# Altium project freq_conv_test_unit_sch.PrjPcb
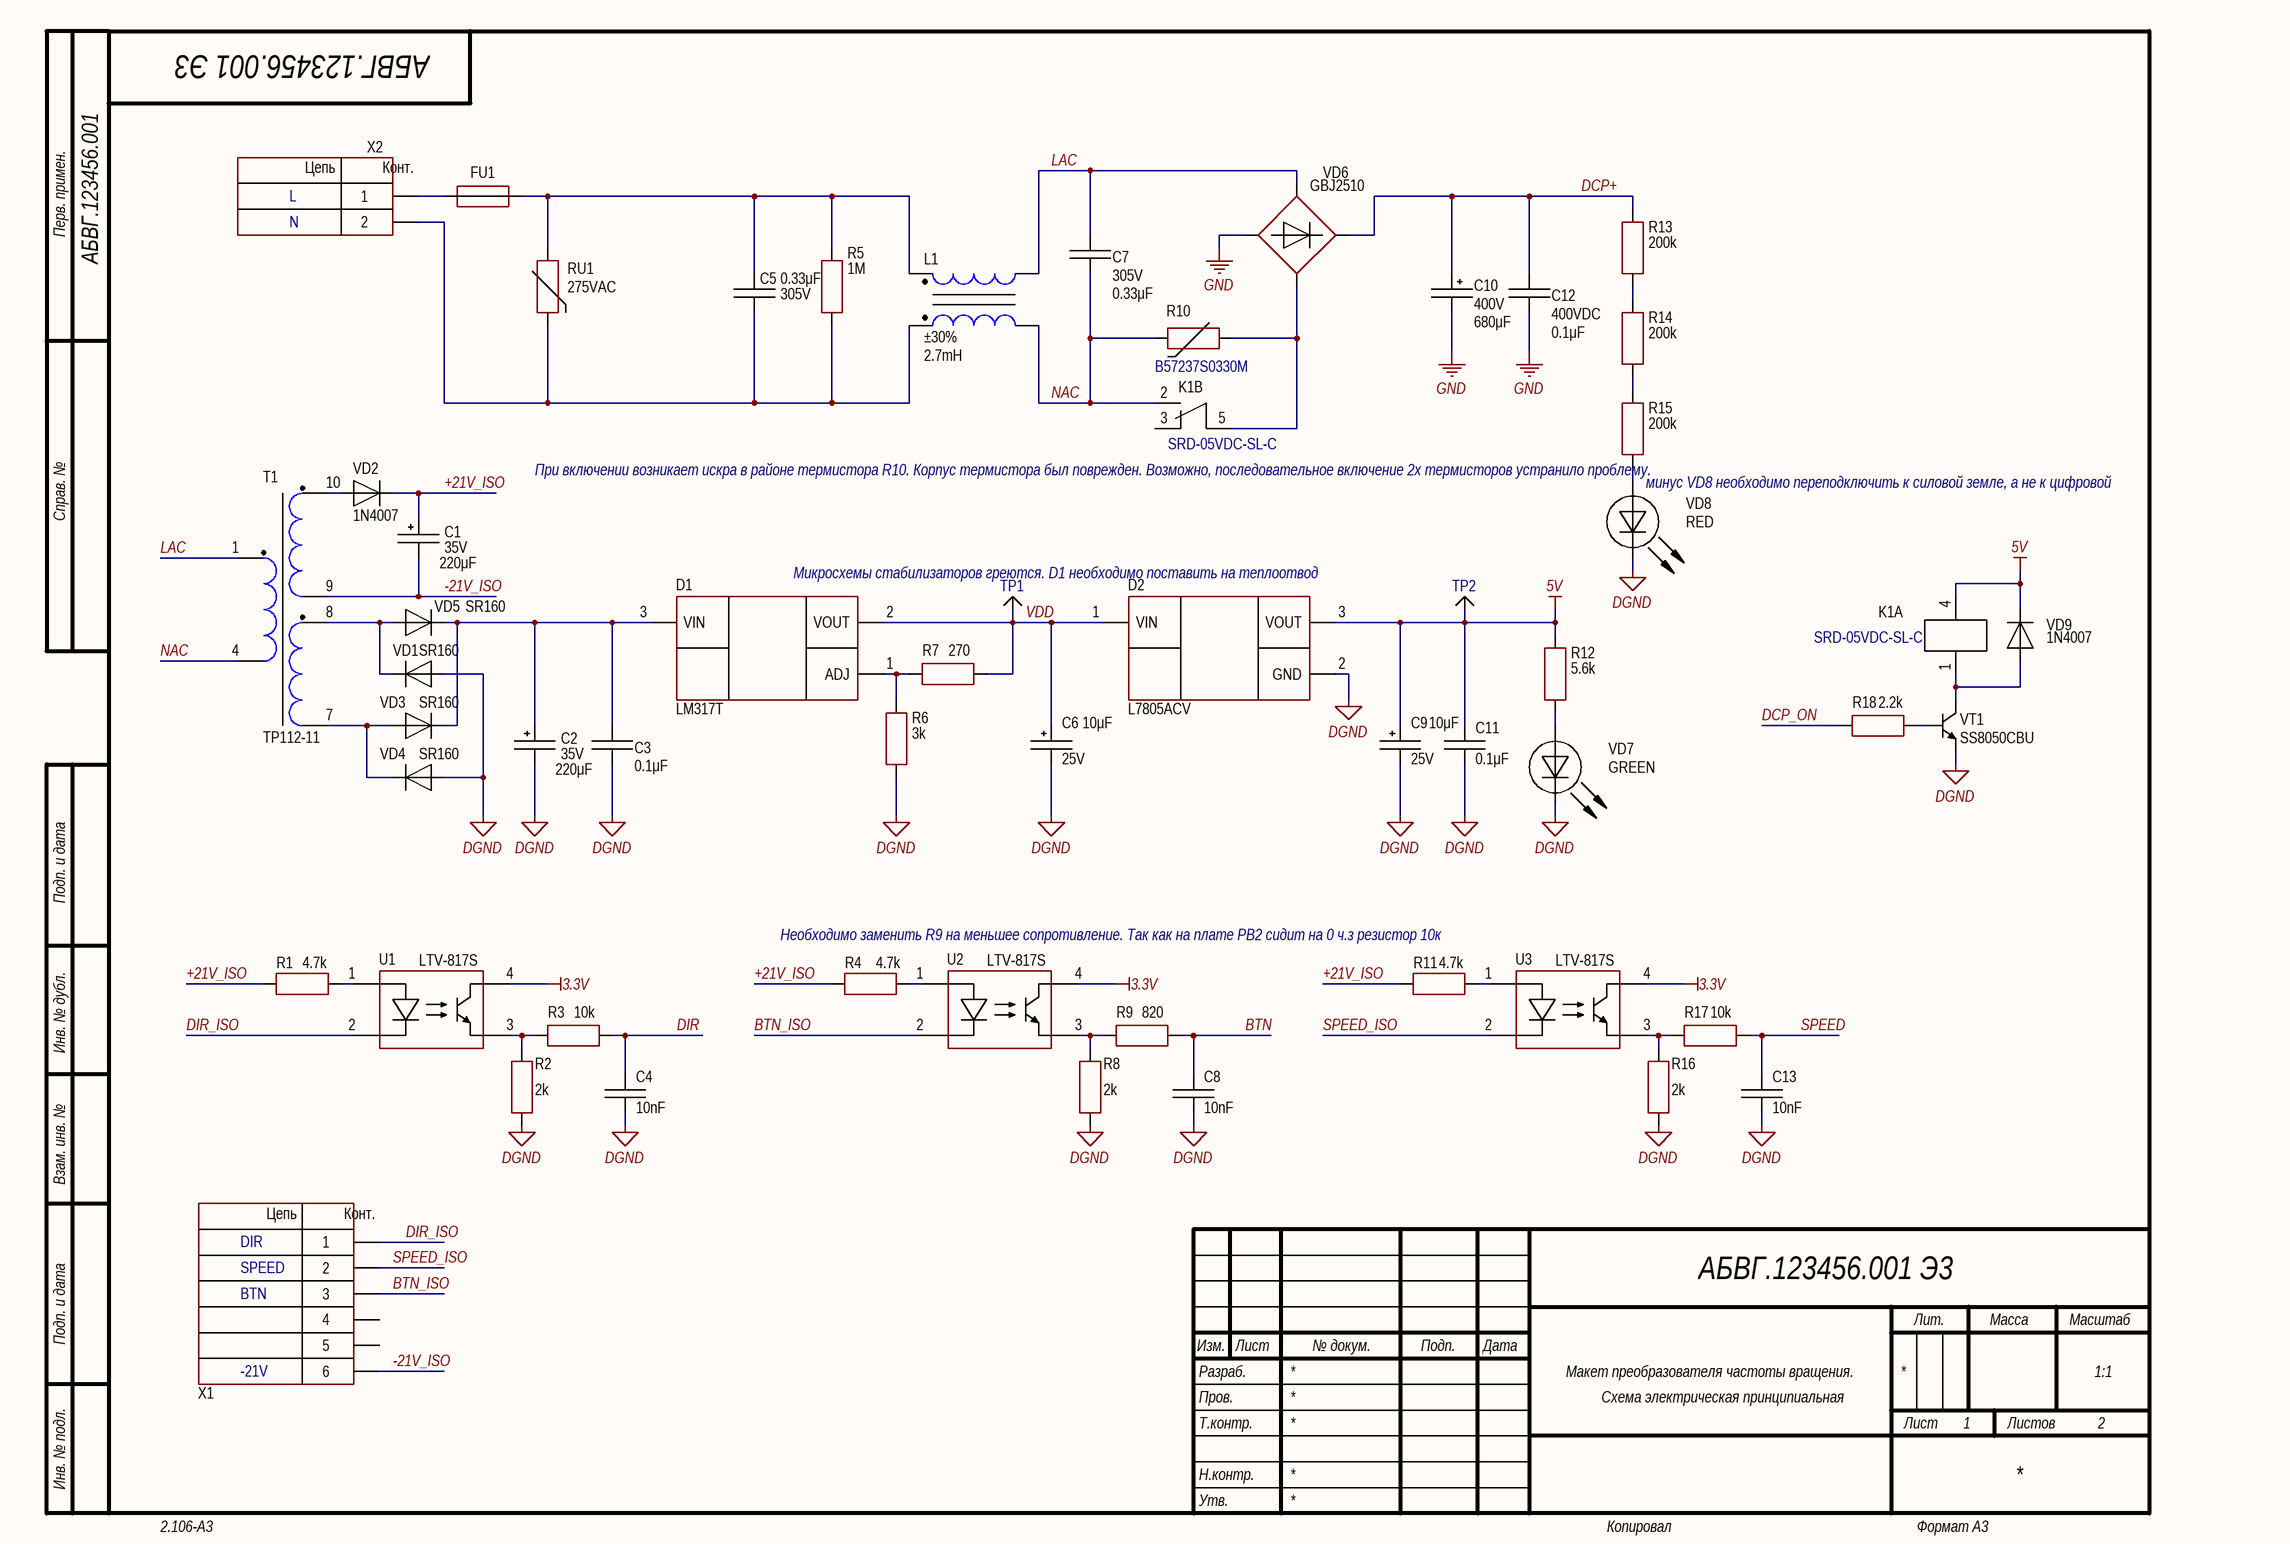
[diagram p0: Sheet1.SchDoc]
2 sheets, 127 parts. Net scope: global (net labels, ports and power ports of the same name join across sheets).
Board file: freq_conv_test_unit_pcb.PcbDoc
Sheets:
  Sheet1.SchDoc
  Sheet2.SchDoc

## Sheet Sheet1.SchDoc
size 420 x 297 mm; Address1: Address1; Address2: Address2; Address3: Address3; Address4: Address4; DocumentNumber: АБВГ.123456.001 Э3; SheetNumber: 1; SheetTotal: 2; Scale: 1:1; Title2str: Макет преобразователя частоты вращения.; DocumentType: Схема электрическая принципиальная; FirstReferrence: АБВГ.123456.001

### Parts
C1  value 220μF  Voltage: 35V  [CAP: D8C3.5H12]
C2  value 220μF  Voltage: 35V  [CAP: D8C3.5H12]
C3  value 0.1μF  [CAP: 1206]
C4  value 10nF  [CAP: 1206]
C5  value 0.33μF  Voltage: 305V  [CAP: B32922]
C6  value 10μF  Voltage: 25V  [CAP: D5C2H11]
C7  value 0.33μF  Voltage: 305V  [CAP: B32922]
C8  value 10nF  [CAP: 1206]
C9  value 10μF  Voltage: 25V  [CAP: D5C2H11]
C10  value 680μF  Voltage: 400V  [CAP: D30C10H37]
C11  value 0.1μF  [CAP: 1206]
C12  value 0.1μF  Voltage: 400VDC  [CAP: B32673]
C13  value 10nF  [CAP: 1206]
D1  PartNumber: LM317T  [TO-220F]
D2  PartNumber: L7805ACV  [TO-220F]
FU1  (no value)  [FUSE: FH-101]
K1  Relay, Non Latching, SPDT , 10A , (250VAC , 110VDC)  [SRD-05VDC-SL-C]  (value not drawn)  (parts A,B of 2)
L1  value 2.7mH  Tolerance: ±30%  [IND: B82723A]
R1  value 4.7k  [RES: 1206]
R2  value 2k  [RES: 1206]
R3  value 10k  [RES: 1206]
R4  value 4.7k  [RES: 1206]
R5  value 1M  [RES: Axial 15mm]  (hidden comment: *)
R6  value 3k  [RES: 1206]
R7  value 270  [RES: 1206]
R8  value 2k  [RES: 1206]
R9  value 820  [RES: 1206]  (hidden comment: Resistor film, 10k, ±5%, 1206, 0.25W, -55...+125°C)
R10  PartNumber: B57237S0330M  [RES: B57237 (NTC)]
R11  value 4.7k  [RES: 1206]
R12  value 5.6k  [RES: 1206]
R13  value 200k  [RES: 1206]
R14  value 200k  [RES: 1206]
R15  value 200k  [RES: 1206]
R16  value 2k  [RES: 1206]
R17  value 10k  [RES: 1206]
R18  value 2.2k  [RES: 1206]
RU1  MaxVoltage: 275VAC  [VARISTOR: B72214]
T1  Package: TP112-11  [TRANS: TP-112]
TP1  Test_Point  [TEST POINT KEYSTONE]  (value not drawn)
TP2  Test_Point  [TEST POINT KEYSTONE]  (value not drawn)
U1  PartNumber: LTV-817S  [4-SMD]
U2  PartNumber: LTV-817S  [4-SMD]
U3  PartNumber: LTV-817S  [4-SMD]
VD1  PartNumber: SR160  [DIODE: DO41]
VD2  PartNumber: 1N4007  [DIODE: DO41]
VD3  PartNumber: SR160  [DIODE: DO41]
VD4  PartNumber: SR160  [DIODE: DO41]
VD5  PartNumber: SR160  [DIODE: DO41]
VD6  (no value)  [DIODE: GBJ FLAT]
VD7  Color: GREEN  [LED: 1206G]
VD8  Color: RED  [LED: 1206R]
VD9  PartNumber: 1N4007  [DIODE: DO41]
VT1  (no value)  [TO-92 - formed leads]
X1  (no value)  [CON: PLS-6]
X2  (no value)  [DG128-7.5-02P]

### Nets
3.3V: U1.4(C) U2.4(C) U3.4(C)
5V: C9.1 C11.2 D2.3(VOUT) K1.4 R12.2 TP2.1 VD9.2
DGND: C2.2 C3.1 C4.1 C6.2 C8.1 C9.2 C11.1 C13.1 D2.2(GND) R2.1 R6.1 R8.1 R16.1 VD1.1 VD4.1 VD7.2(C) VD8.2(C) VT1.1(E)
GND: C10.2 C12.2 VD6.1
+21V_ISO: C1.1 R1.1 R4.1 R11.1 VD2.2
-21V_ISO: C1.2 T1.9 X1.6
BTN: C8.2 R9.1
BTN_ISO: U2.2(C) X1.3
DCP+: C10.1 C12.1 R13.2 VD6.3
DCP_ON: R18.1
DIR: C4.2 R3.1
DIR_ISO: U1.2(C) X1.1
LAC: C7.1 L1.1 T1.1 VD6.2
NAC: C7.2 K1.2 L1.4 R10.2 T1.4
SPEED: C13.2 R17.1
SPEED_ISO: U3.2(C) X1.2
VDD: C6.1 D1.2(VOUT) D2.1(VIN) R7.2 TP1.1
NetC2_1: C2.1 C3.2 D1.3(VIN) VD3.2 VD5.2
NetC5_1: C5.1 FU1.2 L1.2 R5.2 RU1.1
NetC5_2: C5.2 L1.3 R5.1 RU1.2 X2.2
NetD1_1: D1.1(ADJ) R6.2 R7.1
NetFU1_1: FU1.1 X2.1
NetK1_1: K1.1 VD9.1 VT1.3(C)
NetK1_5: K1.5 R10.1 VD6.4
NetR1_2: R1.2 U1.1(A)
NetR2_2: R2.2 R3.2 U1.3(E)
NetR4_2: R4.2 U2.1(A)
NetR8_2: R8.2 R9.2 U2.3(E)
NetR11_2: R11.2 U3.1(A)
NetR12_1: R12.1 VD7.1(A)
NetR13_1: R13.1 R14.2
NetR14_1: R14.1 R15.2
NetR15_1: R15.1 VD8.1(A)
NetR16_2: R16.2 R17.2 U3.3(E)
NetR18_2: R18.2 VT1.2(B)
NetT1_7: T1.7 VD3.1 VD4.2
NetT1_8: T1.8 VD1.2 VD5.1
NetT1_10: T1.10 VD2.1

Not connected (* = marked no-connect by the designer): K1 3; X1 4 5

### Notes on the sheet
- L
- N
- (near R15) При включении возникает искра в районе термистора R10. Корпус термистора был поврежден. Возможно, последовательное включение 2х термисторов устранило проблему.
- минус VD8 необходимо переподключить к силовой земле, а не к цифровой
- (near TP1) Микросхемы стабилизаторов греются. D1 необходимо поставить на теплоотвод
- Необходимо заменить R9 на меньшее сопротивление. Так как на плате PB2 сидит на 0 ч.з резистор 10к
- DIR
- SPEED
- BTN
- -21V
- Перв. примен.
- Справ. №
- Подп. и дата
- Инв. № дубл.
- Взам. инв. №
- Разраб.
- Изм.
- Лист
- № докум.
- Подп.
- Дата
- Лит.
- Масса
- Масштаб
- Пров.
- Т.контр.
- Листов
- Инв. № подл.
- Утв.
- Н.контр.
- 2.106-A3
- Копировал
- Формат А3
- (in symbol KLS2-128-7.50-02P-4S (DG128-7.5-02P)) Цепь; Конт.
- (in symbol PLS-6) Цепь; Конт.

### Library data of the parts
C1 C2 = Aluminium: PartNumber: 9000565901; ValueManufacturerPartNumber: Aluminium capacitor, 220μF, 35V, ±20%, 54mOhm, 8x12x3.5 mm, -40...+105°C; TypeCapacitor: Aluminium capacitor; Tolerance: ±20%; Impedance: 54mOhm; Art: 9000565902; Manufacturer: ?; Package: 8x12x3.5 mm; HelpURL: https://www.chipdip.ru/product0/9000565902; Temperature: -40...+105°C; Price ChipDip: 13
C3 C11 = Ceramic_1206: PartNumber: Ceramic capacitor, 0.1μF,   50V; ValueManufacturerPartNumber: Ceramic capacitor, 0.1μF, X7R, ±10%, 50V, 1206, -55...+125°C; TypeCapacitor: Ceramic capacitor; Tolerance: ±10%; TypeDielectric: X7R; Voltage: 50V; Manufacturer: *; Package: 1206; HelpURL: https://www.chipdip.ru/product0/42211; Temperature: -55...+125°C; Price ChipDip: 11
C4 C8 C13 = Ceramic_1206: PartNumber: Ceramic capacitor, 10nF,   50V; ValueManufacturerPartNumber: Ceramic capacitor, 10nF, X7R, ±10%, 50V, 1206, -55...+125°C; TypeCapacitor: Ceramic capacitor; Tolerance: ±10%; TypeDielectric: X7R; Voltage: 50V; Manufacturer: *; Package: 1206; HelpURL: https://www.chipdip.ru/product0/17180; Temperature: -55...+125°C; Price ChipDip: 13
  C4: ClassName: optoiso1
  C8: ClassName: optoiso2
  C13: ClassName: optoiso3
C5 C7 = Film: Manufacturer: Epcos; PartNumber: B32922-C3334-K; ValueManufacturerPartNumber: Film capacitor X2, 0.33μF, 305V, ±10%, ?, 18x14x8, -40...+110°C; TypeCapacitor: Film capacitor X2; Tolerance: ±10%; Package: 18x14x8; HelpURL: https://www.chipdip.ru/product/b32922-c3334-k; Temperature: -40...+110°C; Impedance: ?; Price ChipDip: 59
C6 C9 = Aluminium: PartNumber: 9000565842; ValueManufacturerPartNumber: Aluminium capacitor, 10μF, 25V, ±20%, 54mOhm, ?, -40...+105°C; TypeCapacitor: Aluminium capacitor; Tolerance: ±20%; Impedance: 54mOhm; Manufacturer: ?; Package: ?; HelpURL: https://www.chipdip.ru/product0/9000565842; Temperature: -40...+105°C; Price ChipDip: 9; Art: 9000565842
C10 = Aluminium: Manufacturer: JB Capacitors; PartNumber: JNE2G681M10003000600; ValueManufacturerPartNumber: Aluminium capacitor, 680μF, 400V, ±20%, ?, 30x10x60 mm, -25...+105°C; TypeCapacitor: Aluminium capacitor; Tolerance: ±20%; Art: 9000565973; Package: 30x10x60 mm; HelpURL: https://www.chipdip.ru/product0/9000565973; Temperature: -25...+105°C; Impedance: ?; Price ChipDip: 700; Price Ali: 853
C12 = Film: Manufacturer: Epcos; PartNumber: B32683A4104J000; ValueManufacturerPartNumber: Film capacitor, 0.1μF, 400VDC, ±10%, ?, 26.5x16.5x8.5 mm, -55...+100°C; TypeCapacitor: Film capacitor; Tolerance: ±10%; Package: 26.5x16.5x8.5 mm; HelpURL: https://www.chipdip.ru/product0/9000614069; Temperature: -55...+100°C; Impedance: ?; Price ChipDip: 160; Price Ali: 90
D1 = LM317: Adjustable voltage regulator; Manufacturer: STMicroelectronics; VoltageInput: 1.2…37V; CurrentOutput: 1.5A; Art: 268916202; HelpURL: https://www.chipdip.ru/product/lm317t; Package: TO-220SG; ComponentType: Adjustable voltage regulator; ValueManufacturerPartNumber: =ComponentType+', '+DataRate+', '+Isolation+', '+Supply+', '+Temperature+', '+Package; Temperature: 0...125°C; MaxDropout: *; VoltageOutput: *; Price ChipDip: 60
D2 = 78XX: Linear voltage regulator; Manufacturer: STMicroelectronics; VoltageInput: 35V; CurrentOutput: 1.5A; VoltageOutput: 5V; Art: 9000107125; HelpURL: https://www.chipdip.ru/product/l7805acv-dg; Package: *; ComponentType: Linear voltage regulator; ValueManufacturerPartNumber: =ComponentType+', '+DataRate+', '+Isolation+', '+Supply+', '+Temperature+', '+Package; Temperature: *; MaxDropout: *; Price ChipDip: 41
FU1 = FUSE: Manufacturer: Dragon City Industries; PartNumber: FH-101; ValueManufacturerPartNumber: *,  FH-101, *; Art: 45989; Package: FH-101; HelpURL: https://www.chipdip.ru/product/fh-101; Temperature: *; Value: *; Price ChipDip: 38
K1 = SRD-05VDC-SL-C: Manufacturer: Ningbo Songle Relay; Switching Voltage: (250VAC , 110VDC) Max; Coil Voltage: 5VDC; HelpURL: https://www.chipdip.ru/product0/8001965486?from=suggest_product; CurrentMax: 10A; Price ChipDip: 160; PartNumber: SRD-05VDC-SL-C
L1 = B82723A: Manufacturer: TDK (TDK-Lambda); PartNumber: B82723A2402N1; TypeInductor: Fixed inductor; TypeMatiriel: CuNi18Zn20; Stray inductance: 30uH; Rated voltage: 250V; Package: B82723A; HelpURL: https://www.chipdip.ru/product0/8534720954; ValueManufacturerPartNumber: =TypeInductor+', '+Value+', '+Tolerance+', '+Package+', '+TypeMatiriel+', '+AL; Price ChipDip: 400
R1 R4 R11 = Resistor_1206: Manufacturer: Yageo; PartNumber: RC1206JR-07100RL; ValueManufacturerPartNumber: Resistor film, 4.7k, ±5%, 1206, 0.25W, -55...+125°C; TypeResistor: Resistor film; Power: 0.25W; Tolerance: ±5%; Package: 1206; HelpURL: https://www.digikey.com/product-detail/en/yageo/RC1206JR-07100RL/311-100ERCT-ND/732153; Temperature: -55...+125°C
  R1: ClassName: optoiso1
  R4: ClassName: optoiso2
  R11: ClassName: optoiso3
R2 R8 R16 = Resistor_1206: Manufacturer: Yageo; PartNumber: RC1206JR-07100RL; ValueManufacturerPartNumber: Resistor film, 2k, ±5%, 1206, 0.25W, -55...+125°C; TypeResistor: Resistor film; Power: 0.25W; Tolerance: ±5%; Package: 1206; HelpURL: https://www.digikey.com/product-detail/en/yageo/RC1206JR-07100RL/311-100ERCT-ND/732153; Temperature: -55...+125°C
  R2: ClassName: optoiso1
  R8: ClassName: optoiso2
  R16: ClassName: optoiso3
R3 R17 = Resistor_1206: Manufacturer: Yageo; PartNumber: RC1206JR-07100RL; ValueManufacturerPartNumber: Resistor film, 10k, ±5%, 1206, 0.25W, -55...+125°C; TypeResistor: Resistor film; Power: 0.25W; Tolerance: ±5%; Package: 1206; HelpURL: https://www.digikey.com/product-detail/en/yageo/RC1206JR-07100RL/311-100ERCT-ND/732153; Temperature: -55...+125°C
  R3: ClassName: optoiso1
  R17: ClassName: optoiso3
R5 = Resistor_Axial: Tolerance: ±5%; Manufacturer: *; PartNumber: *; Package: *; HelpURL: *; ValueManufacturerPartNumber: *; Temperature: *; TypeResistor: *; Power: *
R6 = Resistor_1206: Manufacturer: Yageo; PartNumber: RC1206JR-07100RL; ValueManufacturerPartNumber: Resistor film, 3k, ±5%, 1206, 0.25W, -55...+125°C; TypeResistor: Resistor film; Power: 0.25W; Tolerance: ±5%; Package: 1206; HelpURL: https://www.digikey.com/product-detail/en/yageo/RC1206JR-07100RL/311-100ERCT-ND/732153; Temperature: -55...+125°C
R7 = Resistor_1206: Manufacturer: Yageo; PartNumber: RC1206JR-07100RL; ValueManufacturerPartNumber: Resistor film, 270, ±5%, 1206, 0.25W, -55...+125°C; TypeResistor: Resistor film; Power: 0.25W; Tolerance: ±5%; Package: 1206; HelpURL: https://www.digikey.com/product-detail/en/yageo/RC1206JR-07100RL/311-100ERCT-ND/732153; Temperature: -55...+125°C
R9 = Resistor_1206: Manufacturer: Yageo; PartNumber: RC1206JR-07100RL; ValueManufacturerPartNumber: Resistor film, 820, ±5%, 1206, 0.25W, -55...+125°C; Package: 1206; HelpURL: https://www.digikey.com/product-detail/en/yageo/RC1206JR-07100RL/311-100ERCT-ND/732153; Temperature: -55...+125°C; TypeResistor: Resistor film; Power: 0.25W; Tolerance: ±5%; ClassName: optoiso2
R10 = NTC: Maximum permissible capacitance 900uF; Manufacturer: Epcos; ValueManufacturerPartNumber: NTC resistor, 33, ±20%, pitch 7.5mm, 2.5A, -55...+170°C; TypeResistor: NTC resistor; MaxCurrent: 2.5A; Tolerance: ±20%; Value: 33; Art: 8010235420; Package: pitch 7.5mm; HelpURL: https://www.chipdip.ru/product0/8010235420; Temperature: -55...+170°C; Price ChipDip: 38
R12 = Resistor_1206: Manufacturer: Yageo; PartNumber: RC1206JR-07100RL; ValueManufacturerPartNumber: Resistor film, 5.6k, ±5%, 1206, 0.25W, -55...+125°C; TypeResistor: Resistor film; Power: 0.25W; Tolerance: ±5%; Package: 1206; HelpURL: https://www.digikey.com/product-detail/en/yageo/RC1206JR-07100RL/311-100ERCT-ND/732153; Temperature: -55...+125°C
R13-R15 = Resistor_1206: Manufacturer: Yageo; PartNumber: RC1206JR-07100RL; ValueManufacturerPartNumber: Resistor film, 200k, ±5%, 1206, 0.25W, -55...+125°C; TypeResistor: Resistor film; Power: 0.25W; Tolerance: ±5%; Package: 1206; HelpURL: https://www.digikey.com/product-detail/en/yageo/RC1206JR-07100RL/311-100ERCT-ND/732153; Temperature: -55...+125°C
R18 = Resistor_1206: Manufacturer: Yageo; PartNumber: RC1206JR-07100RL; ValueManufacturerPartNumber: Resistor film, 2.2k, ±5%, 1206, 0.25W, -55...+125°C; TypeResistor: Resistor film; Power: 0.25W; Tolerance: ±5%; Package: 1206; HelpURL: https://www.digikey.com/product-detail/en/yageo/RC1206JR-07100RL/311-100ERCT-ND/732153; Temperature: -55...+125°C
RU1 = Varistor: Manufacturer: EPCOS; PartNumber: B72214-S 271-K101; ValueManufacturerPartNumber: Varistor, 275VAC, pitch 7mm,  -40…85°C; Package: pitch 7mm; HelpURL: https://www.chipdip.ru/product/b72214-s271-k101; Temperature: -40…85°C; TypeResistor: Varistor; Price ChipDip: 36
T1 = TP-112: ValueManufacturerPartNumber: Transformer, TP112-11; TypeTransformer: Transformer; Art: 26337; Manufacturer: ?; HelpURL: https://www.chipdip.ru/product/tp112-11; PartNumber: TP112-11
U1-U3 = LTV-817: Optoisolator; Manufacturer: Lite-On; ValueManufacturerPartNumber: IC optoisolator, 4µs/3µs, 5000Vrms, 35V, -40...+125°C, 4-SMD; Supply: 35V; DataRate: 4µs/3µs; Isolation: 5000Vrms; Art: 972167119; HelpURL: https://www.chipdip.ru/product/pc817-ltv817s; Package: 4-SMD; ComponentType: IC optoisolator; Temperature: -40...+125°C; Price ChipDip: 24
  U1: ClassName: optoiso1
  U2: ClassName: optoiso2
  U3: ClassName: optoiso3
VD1 VD3-VD5 = Diode_single: Manufacturer: China; ValueManufacturerPartNumber: Single diode, 60V, 1A, 700mV, ?, DO-41,  -65…+150°C; TypeDiode: Single diode; Voltage: 60V; Current: 1A; VoltageDrop: 700mV; Art: 20950; Package: DO-41; HelpURL: https://www.chipdip.ru/product/sr160; Temperature: -65…+150°C; RecoveryTime: ?; Price ChipDip: 24
VD2 VD9 = Diode_single: Manufacturer: Diotec Semiconductor; ValueManufacturerPartNumber: Single diode, 1000V, 1A, 1.1V, , DO-41, -65...+175 C; TypeDiode: Single diode; Voltage: 1000V; Current: 1A; VoltageDrop: 1.1V; Package: DO-41; HelpURL: https://www.chipdip.ru/product/1n4007; Temperature: -65...+175 C; Price ChipDip: 5
VD6 = GBJ2510: Manufacturer: DIODES INC.; ValueManufacturerPartNumber: Single phase rectifier, 1000V, 25A, 1.05V, GBJ, -56...+150°C; TypeDiode: Single phase rectifier; Voltage: 1000V; Current: 25A; VoltageDrop: 1.05V; Package: GBJ; HelpURL: https://www.chipdip.ru/product/gbj2510-f; Temperature: -56...+150°C; PartNumber: GBJ2510; Price ChipDip: 290
VD7 = LED_single: ValueManufacturerPartNumber: LED, Green, *, *, *, -55...+150°C; PartNumber: Green Led; TypeDiode: LED; Art: 9000811969; Manufacturer: *; Package: *; HelpURL: https://www.chipdip.ru/product/gnl-1206pgc; Temperature: -55...+150°C; Current: *; VoltageDrop: *; ColorParameter: Green
VD8 = LED_single: ValueManufacturerPartNumber: LED, RED, *, *, *, -55...+150°C; PartNumber: Red Led; TypeDiode: LED; Art: 9000811966; Manufacturer: *; Package: *; HelpURL: https://www.chipdip.ru/product/gnl-1206hrc; Temperature: -55...+150°C; Current: *; VoltageDrop: *; ColorParameter: RED
VT1 = SS8050CBU: Manufacturer: ON Semiconductor; ValueManufacturerPartNumber: NPN transistor, 40V, 1.5A, 190MHz, 1W, 0.5Vmax, 120...200, TO-92, 150°C; TypeTransistor: NPN transistor; VoltageCE: 40V; CurrentCE: 1.5A; VoltageSaturation: 0.5Vmax; Frequency: 190MHz; CurrentGain: 120...200; MaxPower: 1W; Art: 32257; Package: TO-92; HelpURL: https://www.chipdip.ru/product/s8050; Temperature: 150°C; Price ChipDip: 19; PartNumber: SS8050CBU
X1 = PLS-6: Manufacturer: Connfly; ValueManufacturerPartNumber: Connector, 6pin, 2.54mm, 500VAC, 3A; TypeConnector: Connector; VoltageMax: 500VAC; Pitch: 2.54mm; CurrentMax: 3A; Multichannel: 6pin; CommentText: "Разъем"; Art: 389965514; HelpURL: https://www.chipdip.ru/product/pls-6; PartNumber: PLS-6; Price ChipDip: 8
X2 = KLS2-128-7.50-02P-4S (DG128-7.5-02P): Manufacturer: KLS electronic co ltd; ValueManufacturerPartNumber: Connector, 2pin, 9.53mm, 300VAC, 16A; TypeConnector: Connector; VoltageMax: 300VAC; Pitch: 9.53mm; CurrentMax: 16A; Multichannel: 2pin; CommentText: "Разъем"; Art: 9000357654; HelpURL: https://www.chipdip.ru/product/kls2-128-7.50-02p-4s-dg128-7.5-02p; PartNumber: KLS2-128-7.50-02P-4S; Price ChipDip: 16

## Sheet Sheet2.SchDoc
size 420 x 297 mm; Address1: Address1; Address2: Address2; Address3: Address3; Address4: Address4; DocumentNumber: АБВГ.123456.001 Э3; SheetNumber: 2; SheetTotal: 2; Scale: 1:1; DocumentType: Схема электрическая принципиальная; FirstReferrence: АБВГ.123456.001
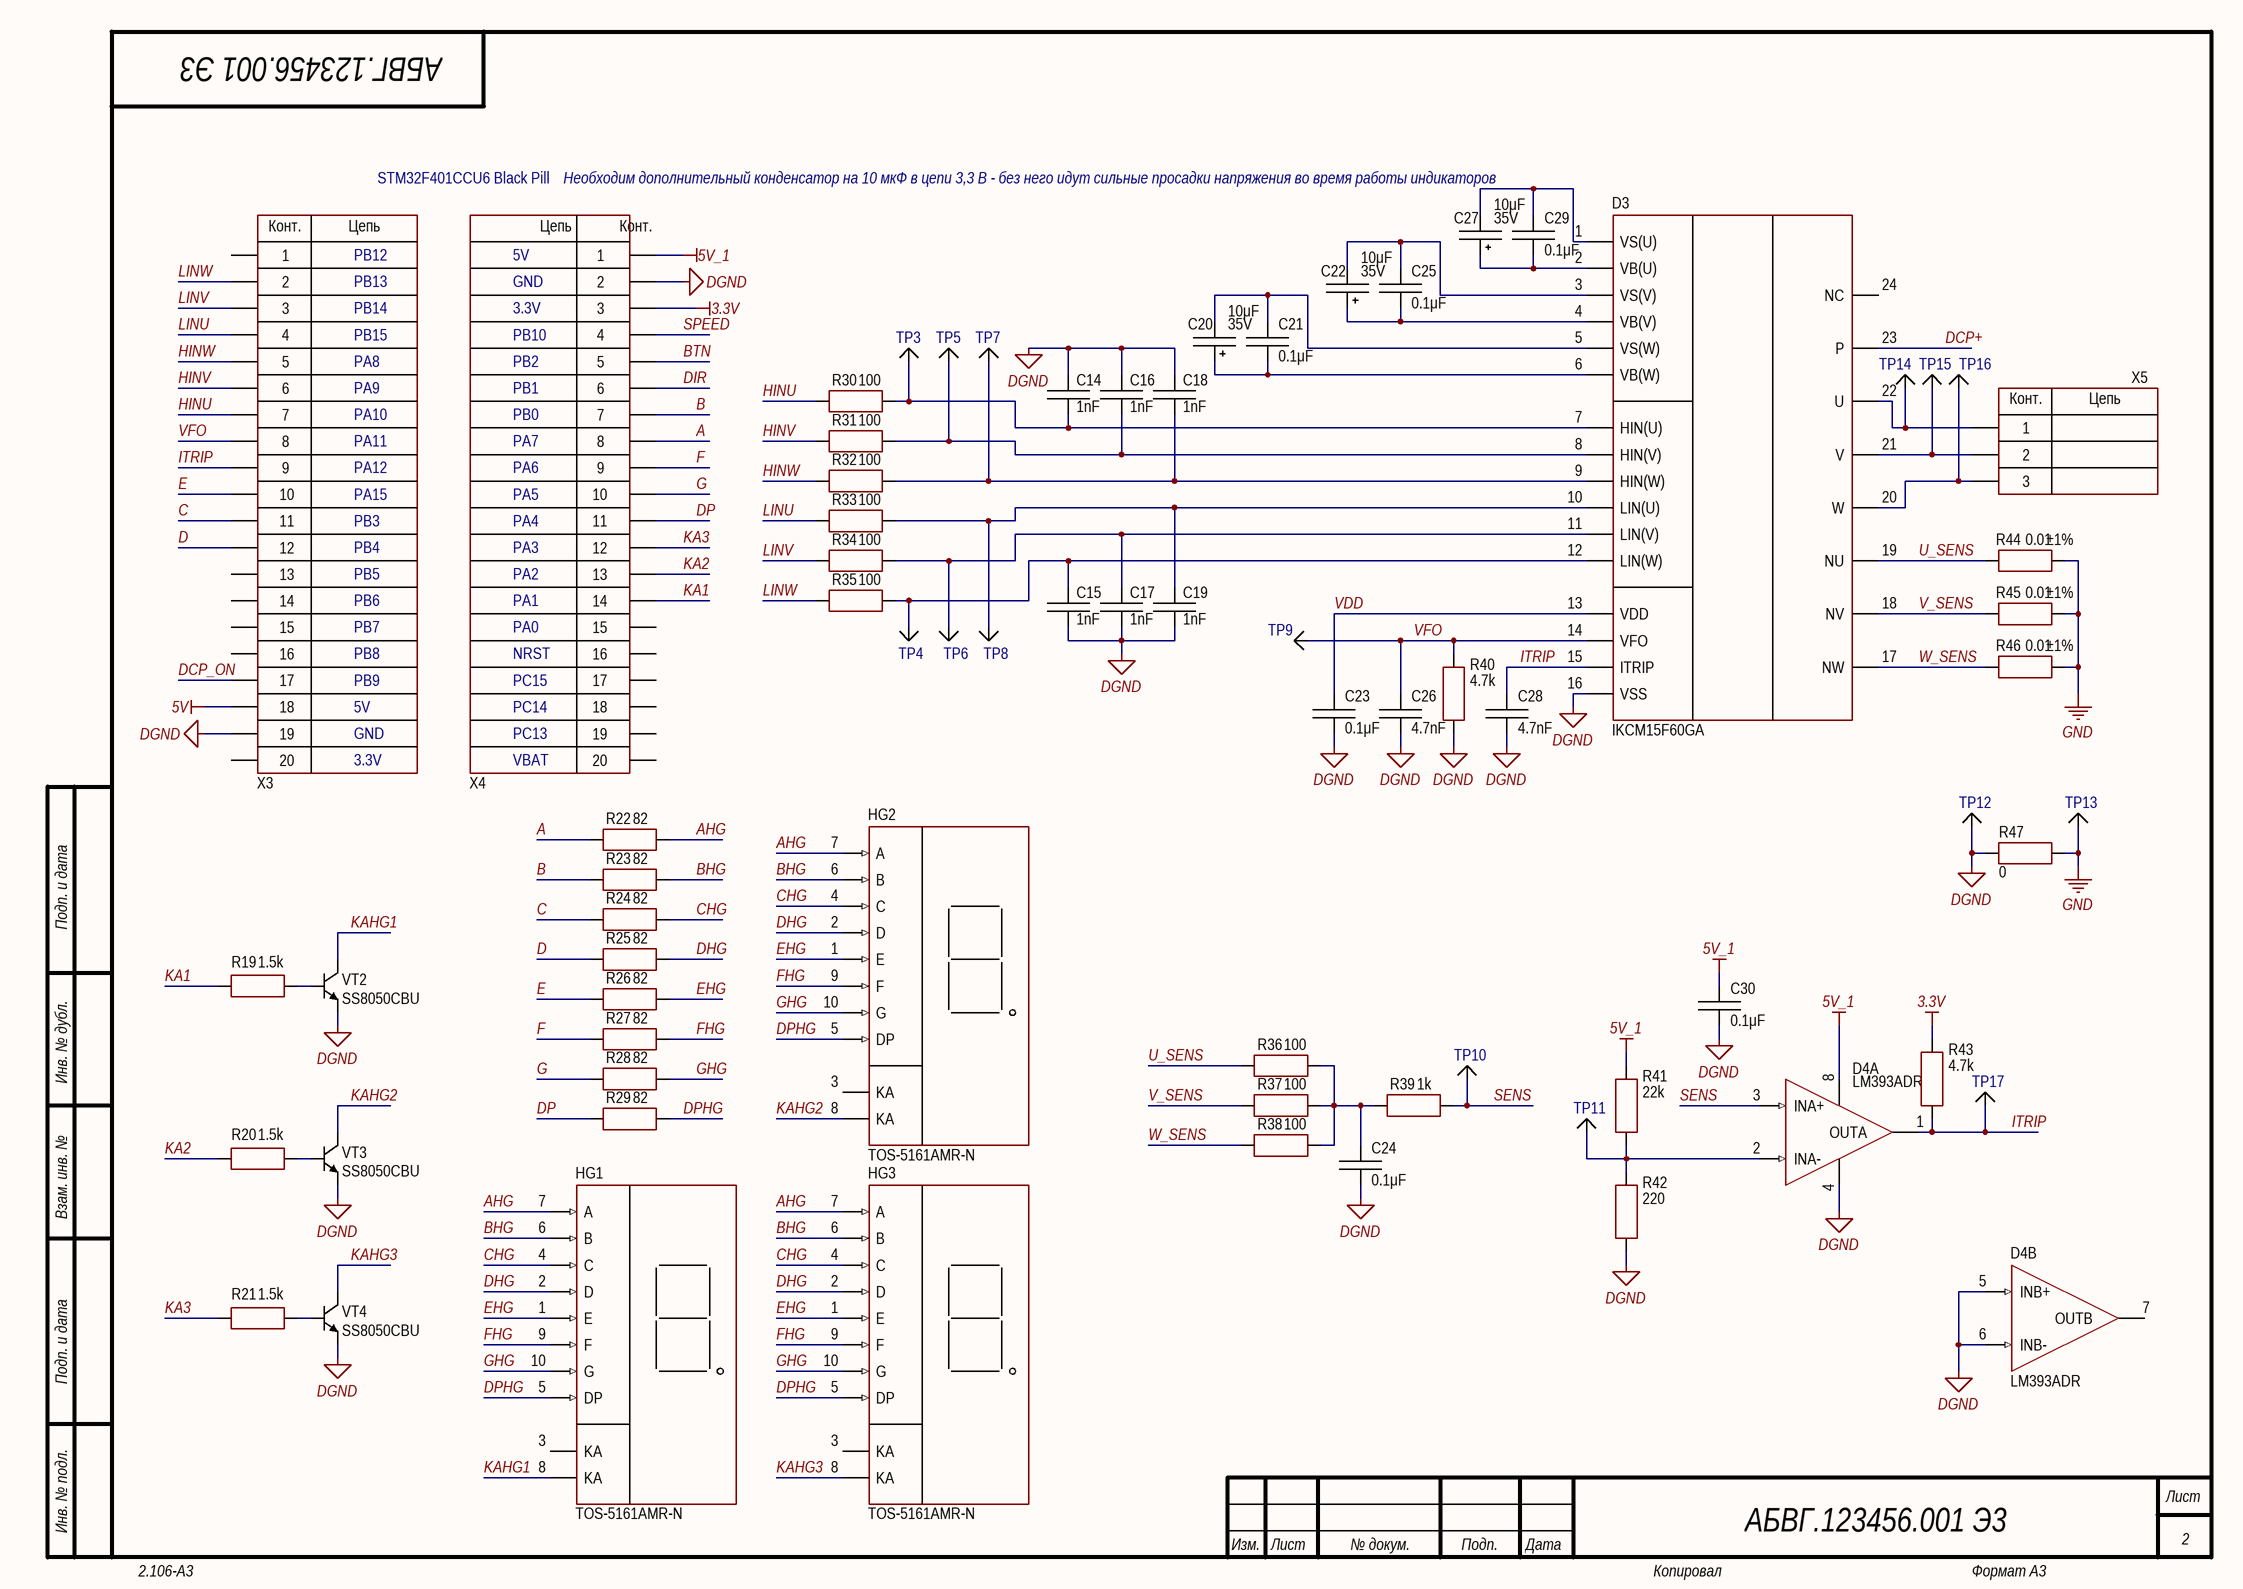
[diagram p1: Sheet2.SchDoc]

### Parts
C14  value 1nF  [CAP: 1206]
C15  value 1nF  [CAP: 1206]
C16  value 1nF  [CAP: 1206]
C17  value 1nF  [CAP: 1206]
C18  value 1nF  [CAP: 1206]
C19  value 1nF  [CAP: 1206]
C20  value 10μF  Voltage: 35V  [CAP: D5C2H11]
C21  value 0.1μF  [CAP: 1206]
C22  value 10μF  Voltage: 35V  [CAP: D5C2H11]
C23  value 0.1μF  [CAP: 1206]
C24  value 0.1μF  [CAP: 1206]
C25  value 0.1μF  [CAP: 1206]
C26  value 4.7nF  [CAP: 1206]
C27  value 10μF  Voltage: 35V  [CAP: D5C2H11]
C28  value 4.7nF  [CAP: 1206]
C29  value 0.1μF  [CAP: 1206]
C30  value 0.1μF  [CAP: 1206]
D3  (no value)  [INF-CIPOS MINI]
D4  (no value)  [8-SOIC]  (parts A,B of 2)
HG1  (no value)  [TOS-5161AMR-N]
HG2  (no value)  [TOS-5161AMR-N]
HG3  (no value)  [TOS-5161AMR-N]
R19  value 1.5k  [RES: 1206]
R20  value 1.5k  [RES: 1206]
R21  value 1.5k  [RES: 1206]
R22  value 82  [RES: 1206]
R23  value 82  [RES: 1206]
R24  value 82  [RES: 1206]
R25  value 82  [RES: 1206]
R26  value 82  [RES: 1206]
R27  value 82  [RES: 1206]
R28  value 82  [RES: 1206]
R29  value 82  [RES: 1206]
R30  value 100  [RES: 1206]
R31  value 100  [RES: 1206]
R32  value 100  [RES: 1206]
R33  value 100  [RES: 1206]
R34  value 100  [RES: 1206]
R35  value 100  [RES: 1206]
R36  value 100  [RES: 1206]
R37  value 100  [RES: 1206]
R38  value 100  [RES: 1206]
R39  value 1k  [RES: 1206]
R40  value 4.7k  [RES: 1206]
R41  value 22k  [RES: 1206]
R42  value 220  [RES: 1206]
R43  value 4.7k  [RES: 1206]
R44  value 0.01  Tolerance: ±1%  [RES: 2512]
R45  value 0.01  Tolerance: ±1%  [RES: 2512]
R46  value 0.01  Tolerance: ±1%  [RES: 2512]
R47  value 0  [RES: 1206]
TP3  Test_Point  [TEST POINT KEYSTONE]  (value not drawn)
TP4  Test_Point  [TEST POINT KEYSTONE]  (value not drawn)
TP5  Test_Point  [TEST POINT KEYSTONE]  (value not drawn)
TP6  Test_Point  [TEST POINT KEYSTONE]  (value not drawn)
TP7  Test_Point  [TEST POINT KEYSTONE]  (value not drawn)
TP8  Test_Point  [TEST POINT KEYSTONE]  (value not drawn)
TP9  Test_Point  [TEST POINT KEYSTONE]  (value not drawn)
TP10  Test_Point  [TEST POINT KEYSTONE]  (value not drawn)
TP11  Test_Point  [TEST POINT KEYSTONE]  (value not drawn)
TP12  Test_Point  [TEST POINT KEYSTONE]  (value not drawn)
TP13  Test_Point  [TEST POINT KEYSTONE]  (value not drawn)
TP14  Test_Point  [TEST POINT KEYSTONE]  (value not drawn)
TP15  Test_Point  [TEST POINT KEYSTONE]  (value not drawn)
TP16  Test_Point  [TEST POINT KEYSTONE]  (value not drawn)
TP17  Test_Point  [TEST POINT KEYSTONE]  (value not drawn)
VT2  (no value)  [TO-92 - formed leads]
VT3  (no value)  [TO-92 - formed leads]
VT4  (no value)  [TO-92 - formed leads]
X3  (no value)  [PBS-20 narrow pitch]
X4  (no value)  [PBS-20 narrow pitch]
X5  (no value)  [DG128-7.5-03P]

### Nets
3.3V: R43.2 X4.3
5V: X3.18
5V_1: C30.2 D4.8(V+) R41.2 X4.1
DGND: C14.2 C15.1 C16.2 C17.1 C18.2 C19.1 C23.1 C24.1 C26.1 C28.1 C30.1 D3.16(VSS) D4.4(GND) D4.5(INB+) D4.6(INB-) R40.1 R42.1 R47.2 TP12.1 VT2.1(E) VT3.1(E) VT4.1(E) X3.19 X4.2
GND: R44.2 R45.2 R46.2 R47.1 TP13.1
A: R22.1 X4.8
AHG: HG1.7(A) HG2.7(A) HG3.7(A) R22.2
B: R23.1 X4.7
BHG: HG1.6(B) HG2.6(B) HG3.6(B) R23.2
BTN: X4.5
C: R24.1 X3.11
CHG: HG1.4(C) HG2.4(C) HG3.4(C) R24.2
D: R25.1 X3.12
DCP+: D3.23(P)
DCP_ON: X3.17
DHG: HG1.2(D) HG2.2(D) HG3.2(D) R25.2
DIR: X4.6
DP: R29.1 X4.11
DPHG: HG1.5(DP) HG2.5(DP) HG3.5(DP) R29.2
E: R26.1 X3.10
EHG: HG1.1(E) HG2.1(E) HG3.1(E) R26.2
F: R27.1 X4.9
FHG: HG1.9(F) HG2.9(F) HG3.9(F) R27.2
G: R28.1 X4.10
GHG: HG1.10(G) HG2.10(G) HG3.10(G) R28.2
HINU: R30.1 X3.7
HINV: R31.1 X3.6
HINW: R32.1 X3.5
ITRIP: C28.2 D3.15(ITRIP) D4.1(OUTA) R43.1 TP17.1 X3.9
KA1: R19.1 X4.14
KA2: R20.1 X4.13
KA3: R21.1 X4.12
KAHG1: HG1.8(KA) VT2.3(C)
KAHG2: HG2.8(KA) VT3.3(C)
KAHG3: HG3.8(KA) VT4.3(C)
LINU: R33.1 X3.4
LINV: R34.1 X3.3
LINW: R35.1 X3.2
SENS: D4.3(INA+) R39.2 TP10.1
SPEED: X4.4
U_SENS: D3.19(NU) R36.1 R44.1
V_SENS: D3.18(NV) R37.1 R45.1
VDD: C23.2 D3.13(VDD)
VFO: C26.2 D3.14(VFO) R40.2 TP9.1 X3.8
W_SENS: D3.17(NW) R38.1 R46.1
NetC14_1: C14.1 D3.7(HIN(U)) R30.2 TP3.1
NetC15_2: C15.2 D3.12(LIN(W)) R35.2 TP4.1
NetC16_1: C16.1 D3.8(HIN(V)) R31.2 TP5.1
NetC17_2: C17.2 D3.11(LIN(V)) R34.2 TP6.1
NetC18_1: C18.1 D3.9(HIN(W)) R32.2 TP7.1
NetC19_2: C19.2 D3.10(LIN(U)) R33.2 TP8.1
NetC20_1: C20.1 C21.1 D3.6(VB(W))
NetC20_2: C20.2 C21.2 D3.5(VS(W))
NetC22_1: C22.1 C25.1 D3.4(VB(V))
NetC22_2: C22.2 C25.2 D3.3(VS(V))
NetC24_2: C24.2 R36.2 R37.2 R38.2 R39.1
NetC27_1: C27.1 C29.1 D3.2(VB(U))
NetC27_2: C27.2 C29.2 D3.1(VS(U))
NetD3_20: D3.20(W) TP16.1 X5.3
NetD3_21: D3.21(V) TP15.1 X5.2
NetD3_22: D3.22(U) TP14.1 X5.1
NetD4_2: D4.2(INA-) R41.1 R42.2 TP11.1
NetR19_2: R19.2 VT2.2(B)
NetR20_2: R20.2 VT3.2(B)
NetR21_2: R21.2 VT4.2(B)

Not connected (* = marked no-connect by the designer): D3 24(NC); D4 7(OUTB); HG1 3(KA); HG2 3(KA); HG3 3(KA); X3 1 13 14 15 16 20; X4 15 16 17 18 19 20

### Notes on the sheet
- STM32F401CCU6 Black Pill
- Необходим дополнительный конденсатор на 10 мкФ в цепи 3,3 В - без него идут сильные просадки напряжения во время работы индикаторов
- PB12
- 5V
- PB13
- PB14
- GND
- 3.3V
- PB15
- PA8
- PA9
- PB10
- PB2
- PB1
- PA10
- PA11
- PB0
- PA7
- PA12
- PA15
- PB3
- PA6
- PA5
- PA4
- PB4
- PB5
- PA3
- PA2
- PB6
- PB7
- PB8
- PA1
- PA0
- NRST
- PB9
- PC15
- PC14
- PC13
- VBAT
- Подп. и дата
- Инв. № дубл.
- Взам. инв. №
- Инв. № подл.
- Изм.
- Лист
- № докум.
- Подп.
- Дата
- 2.106-A3
- Копировал
- Формат А3
- (in symbol DG128-7.5-03P-14) Конт.; Цепь
- (in symbol PBS-20) Конт.; Цепь

### Library data of the parts
C14-C19 = Ceramic_1206: PartNumber: Ceramic capacitor, 1nF,   50V; ValueManufacturerPartNumber: Ceramic capacitor, 1nF, X7R, ±10%, 50V, 1206, -55...+125°C; TypeCapacitor: Ceramic capacitor; Tolerance: ±10%; TypeDielectric: X7R; Voltage: 50V; Manufacturer: *; Package: 1206; HelpURL: https://www.chipdip.ru/product0/9000028006; Temperature: -55...+125°C; Price ChipDip: 8
C20 C22 C27 = Aluminium: PartNumber: 9000565842; ValueManufacturerPartNumber: Aluminium capacitor, 10μF, 35V, ±20%, 54mOhm, ?, -40...+105°C; TypeCapacitor: Aluminium capacitor; Tolerance: ±20%; Impedance: 54mOhm; Art: 9000565850; Manufacturer: ?; Package: ?; HelpURL: https://www.chipdip.ru/product0/9000565850; Temperature: -40...+105°C; Price ChipDip: 9
C21 C23-C25 C29 C30 = Ceramic_1206: as C3 on sheet Sheet1; Manufacturer: *; Package: 1206; HelpURL: https://www.chipdip.ru/product0/42211; Temperature: -55...+125°C; Price ChipDip: 11
C26 C28 = Ceramic_1206: PartNumber: Ceramic capacitor, 4.7nF,   50V; ValueManufacturerPartNumber: Ceramic capacitor, 4.7nF, X7R, ±10%, 50V, 1206, -55...+125°C; TypeCapacitor: Ceramic capacitor; Tolerance: ±10%; TypeDielectric: X7R; Voltage: 50V; Manufacturer: *; Package: 1206; HelpURL: https://www.chipdip.ru/product0/470810702; Temperature: -55...+125°C; Price ChipDip: 16
D3 = IKCM15F60GA: Fully isolated Dual In-Line molded  IGBT module; Manufacturer: INFINEON TECHNOLOGIES AG.; VoltageSupply: 450V; CurrentOutput: 15A; HelpURL: https://www.infineon.com/cms/en/product/power/intelligent-power-modules-ipm/ikcm15f60ga/; Package: IKCM15F60GA; ComponentType: 600 V, 15 A three-phase intelligent power module; ValueManufacturerPartNumber: =ComponentType+', '+VoltageWork+', '+Frequency+', '+CurrentOutput+', '+CMTI+', '+VoltageSupply+', '+Temperature+', '+Package; Temperature: -40...+125°C; Price ChipDip: 3120; Price Ali: 700; PartNumber: IKCM15F60GA
D4 = LM393ADR: Low Power Low Offset Voltage Dual Comparator; Manufacturer: UTD Semiconductor Co.,Ltd; ValueManufacturerPartNumber: IC comparator, Rail-to-Rail, 2...36 V, ±1...±18 V, 0…70°C, SOP-8; Supply: 2...36 V, ±1...±18 V; OutputType: Rail-to-Rail; Propagation Delay: 1.3u; Art: 9001105966; HelpURL: https://www.chipdip.ru/product0/9001105966?from=suggest_product; Package: SOP-8; ComponentType: IC comparator; Temperature: 0…70°C; PartNumber: LM393ADR; Price ChipDip: 7
HG1-HG3 = TOS-5161AMR-N: Single Digit Display LED; Manufacturer: Taiwan Oasis Technology Co., Ltd; Forward Voltage: 2V; Art: 9000447852; HelpURL: https://www.chipdip.ru/product/tos-5161amr-n; Package: TOS-5161AMR-N; ComponentType: Single Digit Display LED; ValueManufacturerPartNumber: =ComponentType+', '+Supply+', '+Temperature+', '+Package; Temperature: -25...+85°C; Price ChipDip: 53; PartNumber: TOS-5161AMR-N
R19-R21 = Resistor_1206: Manufacturer: Yageo; PartNumber: RC1206JR-07100RL; ValueManufacturerPartNumber: Resistor film, 1.5k, ±5%, 1206, 0.25W, -55...+125°C; TypeResistor: Resistor film; Power: 0.25W; Tolerance: ±5%; Package: 1206; HelpURL: https://www.digikey.com/product-detail/en/yageo/RC1206JR-07100RL/311-100ERCT-ND/732153; Temperature: -55...+125°C
R22-R29 = Resistor_1206: Manufacturer: Yageo; PartNumber: RC1206JR-07100RL; ValueManufacturerPartNumber: Resistor film, 82, ±5%, 1206, 0.25W, -55...+125°C; TypeResistor: Resistor film; Power: 0.25W; Tolerance: ±5%; Package: 1206; HelpURL: https://www.digikey.com/product-detail/en/yageo/RC1206JR-07100RL/311-100ERCT-ND/732153; Temperature: -55...+125°C
R30-R38 = Resistor_1206: Manufacturer: Yageo; PartNumber: RC1206JR-07100RL; ValueManufacturerPartNumber: Resistor film, 100, ±5%, 1206, 0.25W, -55...+125°C; TypeResistor: Resistor film; Power: 0.25W; Tolerance: ±5%; Package: 1206; HelpURL: https://www.digikey.com/product-detail/en/yageo/RC1206JR-07100RL/311-100ERCT-ND/732153; Temperature: -55...+125°C
R39 = Resistor_1206: Manufacturer: Yageo; PartNumber: RC1206JR-07100RL; ValueManufacturerPartNumber: Resistor film, 1k, ±5%, 1206, 0.25W, -55...+125°C; TypeResistor: Resistor film; Power: 0.25W; Tolerance: ±5%; Package: 1206; HelpURL: https://www.digikey.com/product-detail/en/yageo/RC1206JR-07100RL/311-100ERCT-ND/732153; Temperature: -55...+125°C
R40 R43 = Resistor_1206: as R1 on sheet Sheet1; Package: 1206; HelpURL: https://www.digikey.com/product-detail/en/yageo/RC1206JR-07100RL/311-100ERCT-ND/732153; Temperature: -55...+125°C
R41 = Resistor_1206: Manufacturer: Yageo; PartNumber: RC1206JR-07100RL; ValueManufacturerPartNumber: Resistor film, 22k, ±5%, 1206, 0.25W, -55...+125°C; TypeResistor: Resistor film; Power: 0.25W; Tolerance: ±5%; Package: 1206; HelpURL: https://www.digikey.com/product-detail/en/yageo/RC1206JR-07100RL/311-100ERCT-ND/732153; Temperature: -55...+125°C
R42 = Resistor_1206: Manufacturer: Yageo; PartNumber: RC1206JR-07100RL; ValueManufacturerPartNumber: Resistor film, 220, ±5%, 1206, 0.25W, -55...+125°C; TypeResistor: Resistor film; Power: 0.25W; Tolerance: ±5%; Package: 1206; HelpURL: https://www.digikey.com/product-detail/en/yageo/RC1206JR-07100RL/311-100ERCT-ND/732153; Temperature: -55...+125°C
R44-R46 = Resistor_2512: Manufacturer: UNI-ROYAL(Uniroyal Elec); PartNumber: 25121WF100MT4E; ValueManufacturerPartNumber: Resistor film, 0.01, ±1%, 2512, 1W, -55...+125°C; TypeResistor: Resistor film; Power: 1W; Package: 2512; HelpURL: https://static.chipdip.ru/lib/922/DOC012922563.pdf; Temperature: -55...+125°C; Price DKO: 10
R47 = Resistor_1206: Manufacturer: Yageo; PartNumber: RC1206JR-07100RL; ValueManufacturerPartNumber: Resistor film, 0, ±5%, 1206, 0.25W, -55...+125°C; TypeResistor: Resistor film; Power: 0.25W; Tolerance: ±5%; Package: 1206; HelpURL: https://www.digikey.com/product-detail/en/yageo/RC1206JR-07100RL/311-100ERCT-ND/732153; Temperature: -55...+125°C
VT2-VT4 = SS8050CBU: as VT1 on sheet Sheet1; Package: TO-92; HelpURL: https://www.chipdip.ru/product/s8050; Temperature: 150°C; Price ChipDip: 19; PartNumber: SS8050CBU
X3 X4 = PBS-20: Manufacturer: Connfly; ValueManufacturerPartNumber: Connector, 20pin, 2.54mm, 500VAC, 3A; TypeConnector: Connector; VoltageMax: 500VAC; Pitch: 2.54mm; CurrentMax: 3A; Multichannel: 20pin; CommentText: "Разъем"; Art: 11807; HelpURL: https://www.chipdip.ru/product/pbs20; PartNumber: PBS-20
X5 = DG128-7.5-03P-14: Manufacturer: Degson Electronics; ValueManufacturerPartNumber: Connector, 3pin, 9.53mm, 300VAC, 16A; TypeConnector: Connector; VoltageMax: 300VAC; Pitch: 9.53mm; CurrentMax: 16A; Multichannel: 3pin; CommentText: "Разъем"; HelpURL: https://www.chipdip.ru/product0/8007163542; PartNumber: DG128-7.5-03P-14; Price ChipDip: 37

## Nets that join several sheets
3.3V: Sheet1 (U1.4 U2.4 U3.4), Sheet2 (R43.2 X4.3)
5V: Sheet1 (7 pins), Sheet2 (X3.18)
DGND: Sheet1 (18 pins), Sheet2 (24 pins)
GND: Sheet1 (C10.2 C12.2 VD6.1), Sheet2 (5 pins)
BTN: Sheet1 (C8.2 R9.1), Sheet2 (X4.5)
DCP+: Sheet1 (C10.1 C12.1 R13.2 VD6.3), Sheet2 (D3.23)
DCP_ON: Sheet1 (R18.1), Sheet2 (X3.17)
DIR: Sheet1 (C4.2 R3.1), Sheet2 (X4.6)
SPEED: Sheet1 (C13.2 R17.1), Sheet2 (X4.4)
VDD: Sheet1 (5 pins), Sheet2 (C23.2 D3.13)